# Altium project ldc-front-connector-hw.PrjPcb
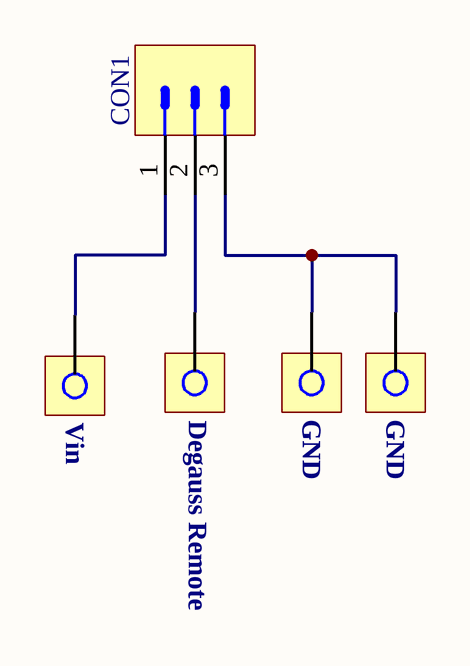
[diagram p0: circuit-ldc-front-connector-hw.SchDoc]
1 sheet, 5 parts. Net scope: global (net labels, ports and power ports of the same name join across sheets).
Board file: pcb-ldc-front-connector-hw.PcbDoc

## Sheet circuit-ldc-front-connector-hw.SchDoc
size A4; Date: 29/06/2021; DrawnBy: Rogério J.M.; Revision: V 1.0; SheetNumber: 1; SheetTotal: 1; Group: ELT

### Parts
CON1  Connector 3 Male  [PHOENIX_1803439]  (value not drawn)
WH1  WIRE HOLE  [WIRE HOLE]  (value not drawn)
WH2  WIRE HOLE  [WIRE HOLE]  (value not drawn)
WH3  WIRE HOLE  [WIRE HOLE]  (value not drawn)
WH4  WIRE HOLE  [WIRE HOLE]  (value not drawn)

### Nets
NetCON1_1: CON1.1 WH1.1
NetCON1_2: CON1.2 WH2.1
NetCON1_3: CON1.3 WH3.1 WH4.1

### Notes on the sheet
- (near WH1) Vin
- (near WH2) Degauss Remote
- GND
- Title:
- Date:
- Project:
- Drawn by:
- Time:
- Revision:
- Sheet
- of
- ENT - AIS - ELT
  Grupo Eletrônica
- Copyright CNPEM 2021.
  This documentation describes Open Hardware and is licensed under the CERN OHL S v2. You may redistribute and modify this documentation under the terms of the CERN OHL S v2. (https://www.ohwr.org/cernohl). This documentation is distributed WITHOUT ANY EXPRESS OR IMPLIED WARRANTY, INCLUDING OF MERCHANTABILITY, SATISFACTORY QUALITY AND FITNESS FOR A PARTICULAR PURPOSE. Please see the CERN OHL S v2 for applicable conditions.
- File:

### Library data of the parts
CON1 = Connector 3 Male: Header; 8 A; 160 V; 3.81; 3; Soldering; 1.2 mm; 2.5 kV; 160/250 V; PBT; Manufacturer: Phoenix Contact; Manufacturer Part Number: 1803439; Código LNLS: AP108375; Max Current Rating: 8A; Number of Positions: 3; Connector Type: Plug; Voltage Rating: 160V; Number of Levels: 1; Voltage: 300V; Voltage Rating (DC): 640mV; Pitch: 3.81mm; Approvals: UL,CSA,VDE,cULus,CB,EAC; Supplier 1: Digi-Key; RoHS: Yes; Category: Terminal Blocks; Stock 1: 13222; Pricing 1: 1=1,32000, 10=1,26500, 50=1,21000, 100=1,17700, 250=1,10000, 500=1,01200, 1000=0,93500, 2500=0,89100, 5000=0,84700 (USD); Mount: Through Hole; Color: Green; Contact Plating: Tin; Housing Color: Green; Housing Material: Polybutylene; Contact Material: Tin; Weight: 4oz; Number of Rows: 1; Packaging: Bulk; Termination: Solder; Orientation: Straight; Package Quantity: 50; Number of Contacts: 3; Gender: Male; Series: MCV; Current Rating: 8A; Number of Poles: 3; Number of Positions Per Level: 3; Current: 8A; Length: 12.82mm; Width: 12.82mm; Height: 12.6mm; Depth: 7.25mm; Lead Free: Lead Free; REACH SVHC: No SVHC; RoHS Compliant: Yes; Flammability Rating: UL94 V-0; ComponentLink1URL: https://datasheet.ciiva.com/795/1803439-795431.pdf?src-supplier=Digi-Key; ComponentLink1Description: https://datasheet.ciiva.com/795/1803439-795431.pdf?src-supplier=Digi-Key; ComponentLink2URL: https://datasheet.ciiva.com/16096/1803439-16096878.pdf?src-supplier=Onlinecomponents.com; ComponentLink2Description: https://datasheet.ciiva.com/16096/1803439-16096878.pdf?src-supplier=Onlinecomponents.com; ComponentLink3URL: https://datasheet.ciiva.com/7630/1697151-7630851.pdf?src-supplier=Element14; ComponentLink3Description: https://datasheet.ciiva.com/7630/1697151-7630851.pdf?src-supplier=Element14; ComponentLink4URL: https://datasheet.ciiva.com/15197/getdatasheetpartid-176372-15197467.pdf?src-supplier=Verical; ComponentLink4Description: https://datasheet.ciiva.com/15197/getdatasheetpartid-176372-15197467.pdf?src-supplier=Verical; ComponentLink5URL: https://datasheet.ciiva.com/29211/740304-da-01-de-leiterplattenstecker-mcv-1-5-3-g-3-81-29211972.pdf?src-supplier=Conrad; ComponentLink5Description: https://datasheet.ciiva.com/29211/740304-da-01-de-leiterplattenstecker-mcv-1-5-3-g-3-81-29211972.pdf?src-supplier=Conrad; Supplier Part Number 1: 277-1222-ND